# Altium schematic sheet CAM.schdoc: =
size A4; Symbol: Sheet-Symbol_A4; Company: 嘉立创EDA; Version: V1.0; Page Size: A4; @Project Name: RK3568B2地瓜派; @Page Count: 27; @Update Date: 2025-09-11; @Create Date: 2025-09-11; @Schematic Name: Schematic1; @Page No: 26; @Page Name: CAM; Device: Sheet-Symbol_A4; Border: 1; Title Block Position: 3; Width: 1170; Height: 825; Region Start: 1; X Region Count: 6; Y Region Count: 4; Blade Width: 10; @Board Name: Board1; @Create Time: 22:44:02; @Update Time: 22:48:10; Organization: ORGANIZATION; Address1: ADDRESS 1; Address2: ADDRESS 2; Address3: ADDRESS 3; Address4: ADDRESS 4; SheetNumber: 26; SheetTotal: 28
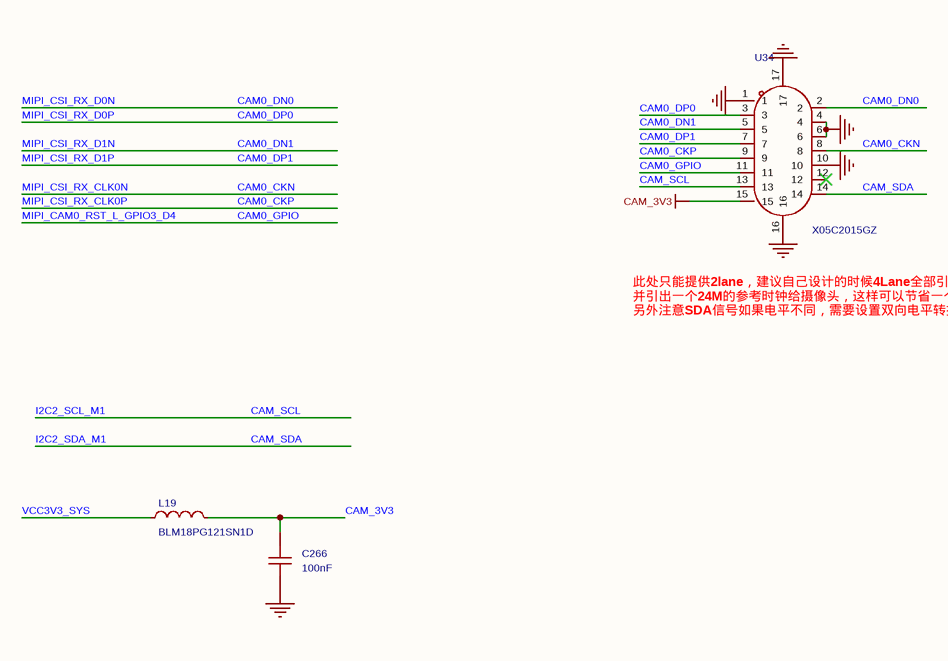
[diagram p0: CAM.schdoc]

## Parts
C266  100nF  [C0603]
L19  BLM18PG121SN1D  [L0603]
U34  X05C2015GZ  [FPC-SMD_15P-P0.50_XKB_X05C2015GZ]

## Nets
CAM_3V3: C266.2 L19.2 U34.15
GND: C266.1 U34.1 U34.4 U34.6 U34.10 U34.16 U34.17
CAM0_CKN: U34.8  [also labelled MIPI_CSI_RX_CLK0N]
CAM0_CKP: U34.9  [also labelled MIPI_CSI_RX_CLK0P]
CAM0_DN0: U34.2  [also labelled MIPI_CSI_RX_D0N]
CAM0_DN1: U34.5  [also labelled MIPI_CSI_RX_D1N]
CAM0_DP0: U34.3  [also labelled MIPI_CSI_RX_D0P]
CAM0_DP1: U34.7  [also labelled MIPI_CSI_RX_D1P]
CAM0_GPIO: U34.11  [also labelled MIPI_CAM0_RST_L_GPIO3_D4]
CAM_SCL: U34.13  [also labelled I2C2_SCL_M1]
CAM_SDA: U34.14  [also labelled I2C2_SDA_M1]
VCC3V3_SYS: L19.1

Not connected (* = marked no-connect by the designer): U34 12*

## Notes on the sheet
- 此处只能提供2lane，建议自己设计的时候4Lane全部引出
  并引出一个24M的参考时钟给摄像头，这样可以节省一个有源晶振
  另外注意SDA信号如果电平不同，需要设置双向电平转换
- Drawn By :
- Checked By :
- Approved By :
- SheetNumber
- SheetTotal
- Revision :
- Time :
- Size :
- Date :
- A4
- DocumentName :
- Project :

## Library data of the parts
C266 = CAP_0603: ConvertToPcb: yes; SymbolName: Capacitance; ModelId: ac125912035d415993ca9572d50418b1; ModelName: C0603_L1.6-W0.8-H0.8; ModelTransform: 62.992,31.496,0,0,0,0,0,0,0; Device: CAP_0603; AddInBom: yes; Supplier Footprint: 0603; FootprintName: C0603; Value: 100nF
L19 = BLM18PG121SN1D: 标称阻抗@测试频率:120Ω@100MHz;误差:±25%;直流电阻(RDC):50mΩ;; Manufacturer: muRata(村田); DC Resistance(DCR): 50mΩ; Number of Circuits: 1; Symbol: BLM18PG121SN1D_C14709; AddInBom: yes; ModelId: 2bc5ec593d464d6ba9807aec0b5673c2; ModelName: L0603_L1.6-W0.8-H0.5_BEAD; ModelTransform: 62.992,31.496,0,180,0,0,0.094,0.629,0; Tolerance: ±25%; Current Rating: 2A; Operating Temperature: -55℃~+125℃; Device: BLM18PG121SN1D; LCSC Part Name: 单路 0603磁珠 阻抗120Ω@100MHz; SupplierPart: C14709; ManufacturerPart: BLM18PG121SN1D; Supplier Footprint: 0603; JLCPCB Part Class: 基础库; Datasheet: https://atta.szlcsc.com/upload/public/pdf/source/20130704/1457706621422.pdf; Supplier: LCSC; ConvertToPcb: yes; FootprintName: L0603; Impedance @ Frequency: 120Ω@100MHz; DC Resistance: 50mΩ; Circuits: 1
U34 = X05C2015GZ: 锁定特性:抽屉式;触点类型:单侧触点/垂直;触点数量:15P;间距:0.5mm;安装方式:立贴;工作温度:-40℃~+85℃;; Manufacturer: XKB Connection(中国星坤); AddInBom: yes; ModelId: da5f495125dc49909a9ff79830e9b65f; ModelTransform: 515.747,118.11,0,0,0,0,0,0,0; Locking Feature: 抽屉式; Number of Contacts: 15P; Pitch: 0.5mm; FFC, FCB Thickness: 0.3mm; Symbol: X05C2015GZ; Device: X05C2015GZ; LCSC Part Name: 间距:0.5mm P数:15P 抽屉式 单侧触点/垂直; SupplierPart: C2880899; ManufacturerPart: X05C2015GZ; Supplier Footprint: SMD,P=0.5mm; JLCPCB Part Class: 扩展库; Datasheet: https://atta.szlcsc.com/upload/public/pdf/source/20211011/FB814D820E44B2E0BC67EE682E3C499B.pdf; Supplier: LCSC; ConvertToPcb: yes; FootprintName: FPC-SMD_15P-P0.50_XKB_X05C2015GZ; ModelName: FPC-SMD_15P-P0.50_XKB_X05C2015GZ; Contact Type: 单侧触点/垂直; Mounting Type: 立贴; Height Above Board: 2mm; Contact Material: 磷青铜; Contact Plating: 金; Operating Temperature: -40℃~+85℃